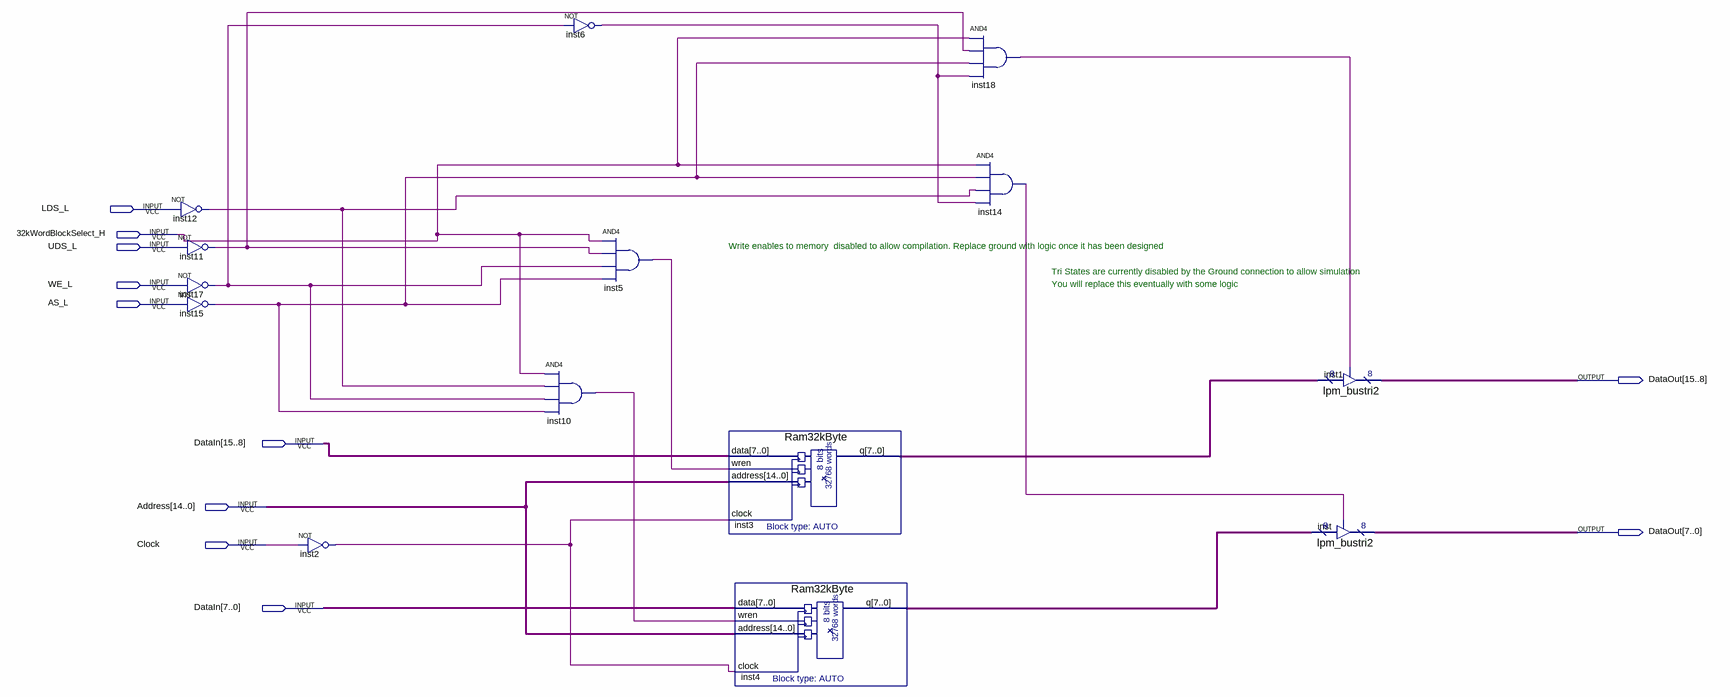
[diagram p0: schematic sheet]
// Quartus schematic SramBlock_32KWord.bdf as structural Verilog: 14 symbols, 11 pins
module SramBlock_32KWord (
  input  LDS_L,
  input  \32kWordBlockSelect_H ,
  input  UDS_L,
  input  WE_L,
  input  AS_L,
  input  [15:0] DataIn,
  input  [14:0] Address,
  input  Clock,
  output [15:0] DataOut
);

  wire inst2_out, inst5_out, inst6_out, inst10_out, inst11_out, inst12_out, inst14_out, inst15_out,
       inst17_out, inst18_out;
  wire [7:0] inst3_q, inst4_q;

  not inst12 (inst12_out, LDS_L);
  not inst11 (inst11_out, UDS_L);
  not inst17 (inst17_out, WE_L);
  not inst15 (inst15_out, AS_L);
  not inst2 (inst2_out, Clock);
  not inst6 (inst6_out, inst17_out);
  and inst10 (inst10_out, \32kWordBlockSelect_H , inst12_out, inst17_out, inst15_out);
  and inst5 (inst5_out, \32kWordBlockSelect_H , inst11_out, inst17_out, inst15_out);
  Ram32kByte inst3 (.data(DataIn[15:8]), .wren(inst5_out), .address(Address), .clock(inst2_out), .q(inst3_q));
  Ram32kByte inst4 (.data(DataIn[7:0]), .wren(inst10_out), .address(Address), .clock(inst2_out), .q(inst4_q));
  and inst18 (inst18_out, \32kWordBlockSelect_H , inst11_out, inst15_out, inst6_out);
  and inst14 (inst14_out, \32kWordBlockSelect_H , inst15_out, inst12_out, inst6_out);
  lpm_bustri2 inst1 (.enabledt(inst18_out), .data(inst3_q), .tridata(DataOut[15:8]));
  lpm_bustri2 inst (.enabledt(inst14_out), .data(inst4_q), .tridata(DataOut[7:0]));

  // Notes on the sheet:
  //   Write enables to memory  disabled to allow compilation. Replace ground with logic once it has been designed
  //   Tri States are currently disabled by the Ground connection to allow simulation
  //   You will replace this eventually with some logic
endmodule
